# Altium schematic sheet 07.MCU_PE_PF.SchDoc
size 297 x 209 mm
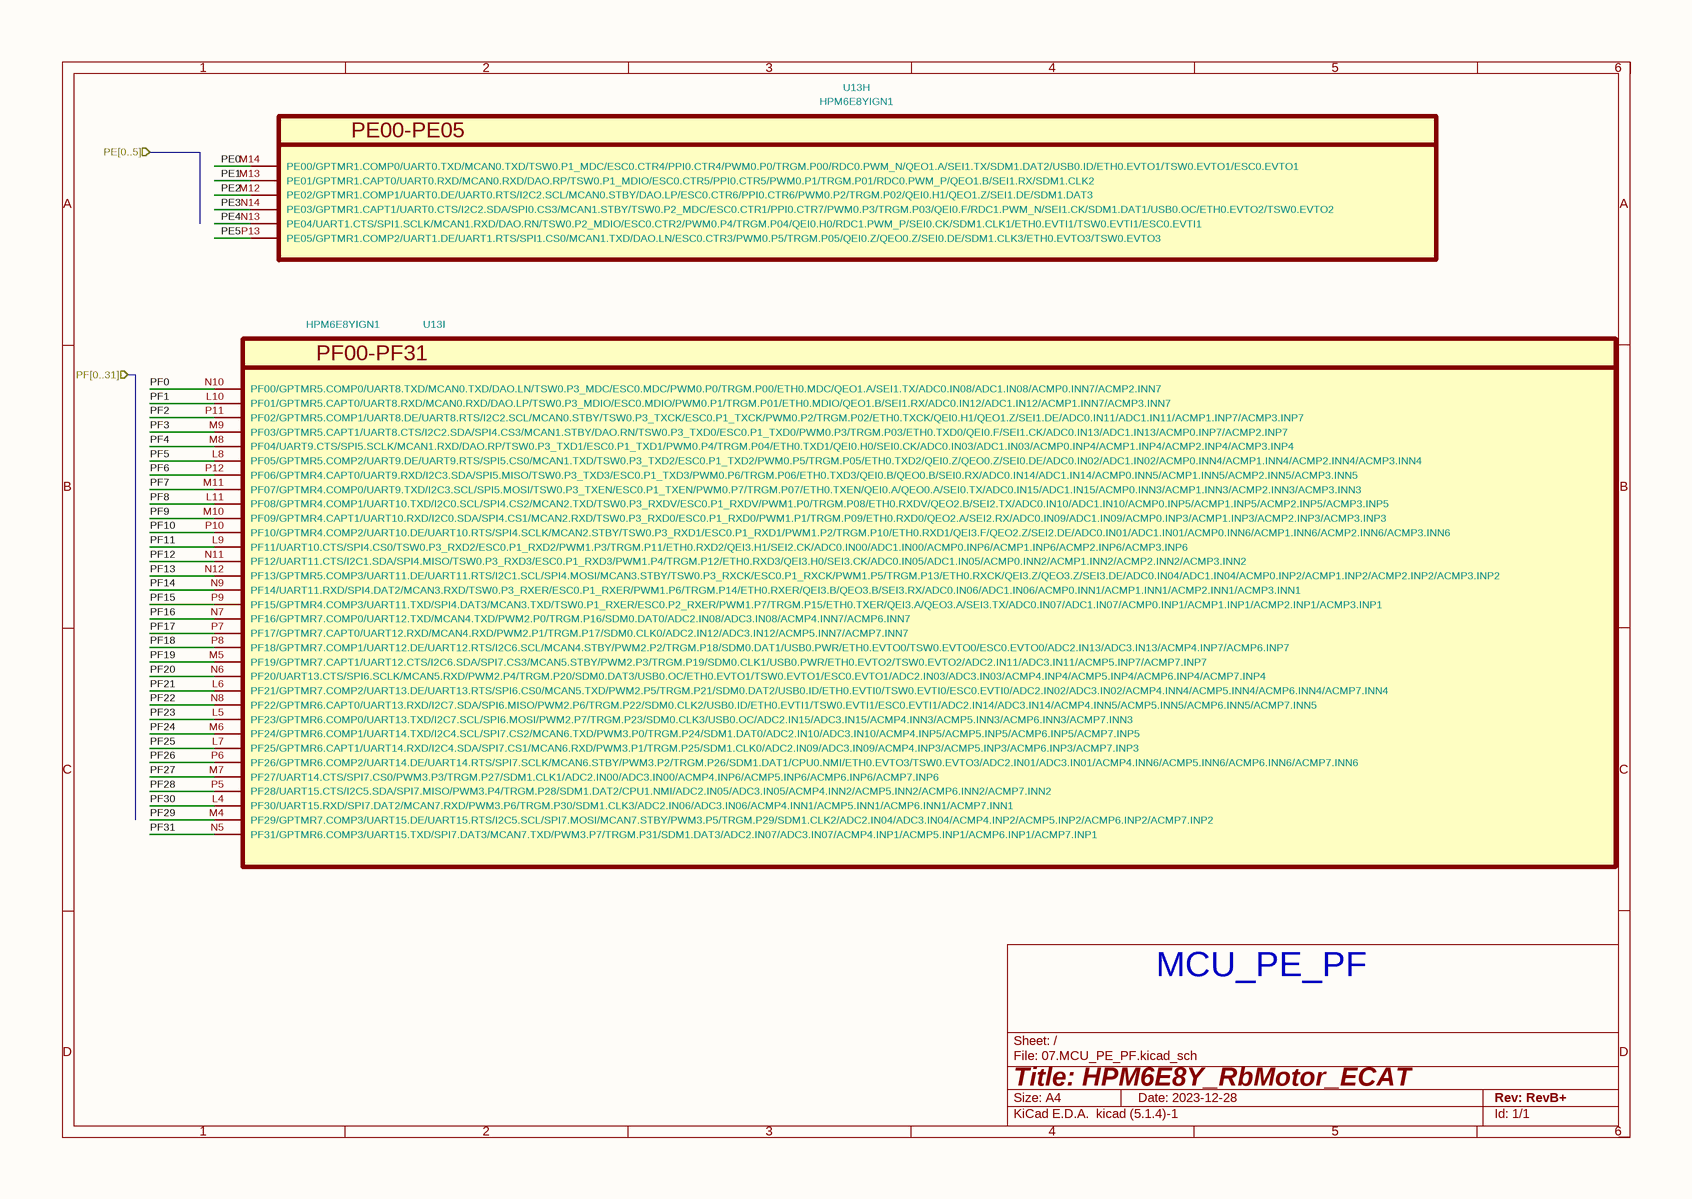
[diagram p0: 07.MCU_PE_PF.SchDoc]

## Parts
U13  HPM6E8YIGN1  [BGA-196_14x14_12.0x12.0mm_P0.8mm]  (parts H,I of 10)

## Ports
PE[0..5] (in), PF[0..31] (in)

## Nets
PE0: U13.M14(PE00/GPTMR1.COMP0/UART0.TXD/MCAN0.TXD/TSW0.P1_MDC/ESC0.CTR4/PPI0.CTR4/PWM0.P0/TRGM.P00/RDC0.PWM_N/QEO1.A/SEI1.TX/SDM1.DAT2/USB0.ID/ETH0.EVTO1/TSW0.EVTO1/ESC0.EVTO1)
PE1: U13.M13(PE01/GPTMR1.CAPT0/UART0.RXD/MCAN0.RXD/DAO.RP/TSW0.P1_MDIO/ESC0.CTR5/PPI0.CTR5/PWM0.P1/TRGM.P01/RDC0.PWM_P/QEO1.B/SEI1.RX/SDM1.CLK2)
PE2: U13.M12(PE02/GPTMR1.COMP1/UART0.DE/UART0.RTS/I2C2.SCL/MCAN0.STBY/DAO.LP/ESC0.CTR6/PPI0.CTR6/PWM0.P2/TRGM.P02/QEI0.H1/QEO1.Z/SEI1.DE/SDM1.DAT3)
PE3: U13.N14(PE03/GPTMR1.CAPT1/UART0.CTS/I2C2.SDA/SPI0.CS3/MCAN1.STBY/TSW0.P2_MDC/ESC0.CTR1/PPI0.CTR7/PWM0.P3/TRGM.P03/QEI0.F/RDC1.PWM_N/SEI1.CK/SDM1.DAT1/USB0.OC/ETH0.EVTO2/TSW0.EVTO2)
PE4: U13.N13(PE04/UART1.CTS/SPI1.SCLK/MCAN1.RXD/DAO.RN/TSW0.P2_MDIO/ESC0.CTR2/PWM0.P4/TRGM.P04/QEI0.H0/RDC1.PWM_P/SEI0.CK/SDM1.CLK1/ETH0.EVTI1/TSW0.EVTI1/ESC0.EVTI1)
PE5: U13.P13(PE05/GPTMR1.COMP2/UART1.DE/UART1.RTS/SPI1.CS0/MCAN1.TXD/DAO.LN/ESC0.CTR3/PWM0.P5/TRGM.P05/QEI0.Z/QEO0.Z/SEI0.DE/SDM1.CLK3/ETH0.EVTO3/TSW0.EVTO3)
PF0: U13.N10(PF00/GPTMR5.COMP0/UART8.TXD/MCAN0.TXD/DAO.LN/TSW0.P3_MDC/ESC0.MDC/PWM0.P0/TRGM.P00/ETH0.MDC/QEO1.A/SEI1.TX/ADC0.IN08/ADC1.IN08/ACMP0.INN7/ACMP2.INN7)
PF1: U13.L10(PF01/GPTMR5.CAPT0/UART8.RXD/MCAN0.RXD/DAO.LP/TSW0.P3_MDIO/ESC0.MDIO/PWM0.P1/TRGM.P01/ETH0.MDIO/QEO1.B/SEI1.RX/ADC0.IN12/ADC1.IN12/ACMP1.INN7/ACMP3.INN7)
PF2: U13.P11(PF02/GPTMR5.COMP1/UART8.DE/UART8.RTS/I2C2.SCL/MCAN0.STBY/TSW0.P3_TXCK/ESC0.P1_TXCK/PWM0.P2/TRGM.P02/ETH0.TXCK/QEI0.H1/QEO1.Z/SEI1.DE/ADC0.IN11/ADC1.IN11/ACMP1.INP7/ACMP3.INP7)
PF3: U13.M9(PF03/GPTMR5.CAPT1/UART8.CTS/I2C2.SDA/SPI4.CS3/MCAN1.STBY/DAO.RN/TSW0.P3_TXD0/ESC0.P1_TXD0/PWM0.P3/TRGM.P03/ETH0.TXD0/QEI0.F/SEI1.CK/ADC0.IN13/ADC1.IN13/ACMP0.INP7/ACMP2.INP7)
PF4: U13.M8(PF04/UART9.CTS/SPI5.SCLK/MCAN1.RXD/DAO.RP/TSW0.P3_TXD1/ESC0.P1_TXD1/PWM0.P4/TRGM.P04/ETH0.TXD1/QEI0.H0/SEI0.CK/ADC0.IN03/ADC1.IN03/ACMP0.INP4/ACMP1.INP4/ACMP2.INP4/ACMP3.INP4)
PF5: U13.L8(PF05/GPTMR5.COMP2/UART9.DE/UART9.RTS/SPI5.CS0/MCAN1.TXD/TSW0.P3_TXD2/ESC0.P1_TXD2/PWM0.P5/TRGM.P05/ETH0.TXD2/QEI0.Z/QEO0.Z/SEI0.DE/ADC0.IN02/ADC1.IN02/ACMP0.INN4/ACMP1.INN4/ACMP2.INN4/ACMP3.INN4)
PF6: U13.P12(PF06/GPTMR4.CAPT0/UART9.RXD/I2C3.SDA/SPI5.MISO/TSW0.P3_TXD3/ESC0.P1_TXD3/PWM0.P6/TRGM.P06/ETH0.TXD3/QEI0.B/QEO0.B/SEI0.RX/ADC0.IN14/ADC1.IN14/ACMP0.INN5/ACMP1.INN5/ACMP2.INN5/ACMP3.INN5)
PF7: U13.M11(PF07/GPTMR4.COMP0/UART9.TXD/I2C3.SCL/SPI5.MOSI/TSW0.P3_TXEN/ESC0.P1_TXEN/PWM0.P7/TRGM.P07/ETH0.TXEN/QEI0.A/QEO0.A/SEI0.TX/ADC0.IN15/ADC1.IN15/ACMP0.INN3/ACMP1.INN3/ACMP2.INN3/ACMP3.INN3)
PF8: U13.L11(PF08/GPTMR4.COMP1/UART10.TXD/I2C0.SCL/SPI4.CS2/MCAN2.TXD/TSW0.P3_RXDV/ESC0.P1_RXDV/PWM1.P0/TRGM.P08/ETH0.RXDV/QEO2.B/SEI2.TX/ADC0.IN10/ADC1.IN10/ACMP0.INP5/ACMP1.INP5/ACMP2.INP5/ACMP3.INP5)
PF9: U13.M10(PF09/GPTMR4.CAPT1/UART10.RXD/I2C0.SDA/SPI4.CS1/MCAN2.RXD/TSW0.P3_RXD0/ESC0.P1_RXD0/PWM1.P1/TRGM.P09/ETH0.RXD0/QEO2.A/SEI2.RX/ADC0.IN09/ADC1.IN09/ACMP0.INP3/ACMP1.INP3/ACMP2.INP3/ACMP3.INP3)
PF10: U13.P10(PF10/GPTMR4.COMP2/UART10.DE/UART10.RTS/SPI4.SCLK/MCAN2.STBY/TSW0.P3_RXD1/ESC0.P1_RXD1/PWM1.P2/TRGM.P10/ETH0.RXD1/QEI3.F/QEO2.Z/SEI2.DE/ADC0.IN01/ADC1.IN01/ACMP0.INN6/ACMP1.INN6/ACMP2.INN6/ACMP3.INN6)
PF11: U13.L9(PF11/UART10.CTS/SPI4.CS0/TSW0.P3_RXD2/ESC0.P1_RXD2/PWM1.P3/TRGM.P11/ETH0.RXD2/QEI3.H1/SEI2.CK/ADC0.IN00/ADC1.IN00/ACMP0.INP6/ACMP1.INP6/ACMP2.INP6/ACMP3.INP6)
PF12: U13.N11(PF12/UART11.CTS/I2C1.SDA/SPI4.MISO/TSW0.P3_RXD3/ESC0.P1_RXD3/PWM1.P4/TRGM.P12/ETH0.RXD3/QEI3.H0/SEI3.CK/ADC0.IN05/ADC1.IN05/ACMP0.INN2/ACMP1.INN2/ACMP2.INN2/ACMP3.INN2)
PF13: U13.N12(PF13/GPTMR5.COMP3/UART11.DE/UART11.RTS/I2C1.SCL/SPI4.MOSI/MCAN3.STBY/TSW0.P3_RXCK/ESC0.P1_RXCK/PWM1.P5/TRGM.P13/ETH0.RXCK/QEI3.Z/QEO3.Z/SEI3.DE/ADC0.IN04/ADC1.IN04/ACMP0.INP2/ACMP1.INP2/ACMP2.INP2/ACMP3.INP2)
PF14: U13.N9(PF14/UART11.RXD/SPI4.DAT2/MCAN3.RXD/TSW0.P3_RXER/ESC0.P1_RXER/PWM1.P6/TRGM.P14/ETH0.RXER/QEI3.B/QEO3.B/SEI3.RX/ADC0.IN06/ADC1.IN06/ACMP0.INN1/ACMP1.INN1/ACMP2.INN1/ACMP3.INN1)
PF15: U13.P9(PF15/GPTMR4.COMP3/UART11.TXD/SPI4.DAT3/MCAN3.TXD/TSW0.P1_RXER/ESC0.P2_RXER/PWM1.P7/TRGM.P15/ETH0.TXER/QEI3.A/QEO3.A/SEI3.TX/ADC0.IN07/ADC1.IN07/ACMP0.INP1/ACMP1.INP1/ACMP2.INP1/ACMP3.INP1)
PF16: U13.N7(PF16/GPTMR7.COMP0/UART12.TXD/MCAN4.TXD/PWM2.P0/TRGM.P16/SDM0.DAT0/ADC2.IN08/ADC3.IN08/ACMP4.INN7/ACMP6.INN7)
PF17: U13.P7(PF17/GPTMR7.CAPT0/UART12.RXD/MCAN4.RXD/PWM2.P1/TRGM.P17/SDM0.CLK0/ADC2.IN12/ADC3.IN12/ACMP5.INN7/ACMP7.INN7)
PF18: U13.P8(PF18/GPTMR7.COMP1/UART12.DE/UART12.RTS/I2C6.SCL/MCAN4.STBY/PWM2.P2/TRGM.P18/SDM0.DAT1/USB0.PWR/ETH0.EVTO0/TSW0.EVTO0/ESC0.EVTO0/ADC2.IN13/ADC3.IN13/ACMP4.INP7/ACMP6.INP7)
PF19: U13.M5(PF19/GPTMR7.CAPT1/UART12.CTS/I2C6.SDA/SPI7.CS3/MCAN5.STBY/PWM2.P3/TRGM.P19/SDM0.CLK1/USB0.PWR/ETH0.EVTO2/TSW0.EVTO2/ADC2.IN11/ADC3.IN11/ACMP5.INP7/ACMP7.INP7)
PF20: U13.N6(PF20/UART13.CTS/SPI6.SCLK/MCAN5.RXD/PWM2.P4/TRGM.P20/SDM0.DAT3/USB0.OC/ETH0.EVTO1/TSW0.EVTO1/ESC0.EVTO1/ADC2.IN03/ADC3.IN03/ACMP4.INP4/ACMP5.INP4/ACMP6.INP4/ACMP7.INP4)
PF21: U13.L6(PF21/GPTMR7.COMP2/UART13.DE/UART13.RTS/SPI6.CS0/MCAN5.TXD/PWM2.P5/TRGM.P21/SDM0.DAT2/USB0.ID/ETH0.EVTI0/TSW0.EVTI0/ESC0.EVTI0/ADC2.IN02/ADC3.IN02/ACMP4.INN4/ACMP5.INN4/ACMP6.INN4/ACMP7.INN4)
PF22: U13.N8(PF22/GPTMR6.CAPT0/UART13.RXD/I2C7.SDA/SPI6.MISO/PWM2.P6/TRGM.P22/SDM0.CLK2/USB0.ID/ETH0.EVTI1/TSW0.EVTI1/ESC0.EVTI1/ADC2.IN14/ADC3.IN14/ACMP4.INN5/ACMP5.INN5/ACMP6.INN5/ACMP7.INN5)
PF23: U13.L5(PF23/GPTMR6.COMP0/UART13.TXD/I2C7.SCL/SPI6.MOSI/PWM2.P7/TRGM.P23/SDM0.CLK3/USB0.OC/ADC2.IN15/ADC3.IN15/ACMP4.INN3/ACMP5.INN3/ACMP6.INN3/ACMP7.INN3)
PF24: U13.M6(PF24/GPTMR6.COMP1/UART14.TXD/I2C4.SCL/SPI7.CS2/MCAN6.TXD/PWM3.P0/TRGM.P24/SDM1.DAT0/ADC2.IN10/ADC3.IN10/ACMP4.INP5/ACMP5.INP5/ACMP6.INP5/ACMP7.INP5)
PF25: U13.L7(PF25/GPTMR6.CAPT1/UART14.RXD/I2C4.SDA/SPI7.CS1/MCAN6.RXD/PWM3.P1/TRGM.P25/SDM1.CLK0/ADC2.IN09/ADC3.IN09/ACMP4.INP3/ACMP5.INP3/ACMP6.INP3/ACMP7.INP3)
PF26: U13.P6(PF26/GPTMR6.COMP2/UART14.DE/UART14.RTS/SPI7.SCLK/MCAN6.STBY/PWM3.P2/TRGM.P26/SDM1.DAT1/CPU0.NMI/ETH0.EVTO3/TSW0.EVTO3/ADC2.IN01/ADC3.IN01/ACMP4.INN6/ACMP5.INN6/ACMP6.INN6/ACMP7.INN6)
PF27: U13.M7(PF27/UART14.CTS/SPI7.CS0/PWM3.P3/TRGM.P27/SDM1.CLK1/ADC2.IN00/ADC3.IN00/ACMP4.INP6/ACMP5.INP6/ACMP6.INP6/ACMP7.INP6)
PF28: U13.P5(PF28/UART15.CTS/I2C5.SDA/SPI7.MISO/PWM3.P4/TRGM.P28/SDM1.DAT2/CPU1.NMI/ADC2.IN05/ADC3.IN05/ACMP4.INN2/ACMP5.INN2/ACMP6.INN2/ACMP7.INN2)
PF29: U13.M4(PF29/GPTMR7.COMP3/UART15.DE/UART15.RTS/I2C5.SCL/SPI7.MOSI/MCAN7.STBY/PWM3.P5/TRGM.P29/SDM1.CLK2/ADC2.IN04/ADC3.IN04/ACMP4.INP2/ACMP5.INP2/ACMP6.INP2/ACMP7.INP2)
PF30: U13.L4(PF30/UART15.RXD/SPI7.DAT2/MCAN7.RXD/PWM3.P6/TRGM.P30/SDM1.CLK3/ADC2.IN06/ADC3.IN06/ACMP4.INN1/ACMP5.INN1/ACMP6.INN1/ACMP7.INN1)
PF31: U13.N5(PF31/GPTMR6.COMP3/UART15.TXD/SPI7.DAT3/MCAN7.TXD/PWM3.P7/TRGM.P31/SDM1.DAT3/ADC2.IN07/ADC3.IN07/ACMP4.INP1/ACMP5.INP1/ACMP6.INP1/ACMP7.INP1)

## Notes on the sheet
- MCU_PE_PF
- 1
- 2
- 3
- 4
- 5
- 6
- A
- B
- C
- D
- Title: HPM6E8Y_RbMotor_ECAT
- File: 07.MCU_PE_PF.kicad_sch
- Sheet: /
- KiCad E.D.A.  kicad (5.1.4)-1
- Size: A4
- Date: 2023-12-28
- Rev: RevB+
- Id: 1/1
- (in symbol HPM6E8YIGN1, part H) PE00-PE05
- (in symbol HPM6E8YIGN1, part I) PF00-PF31

## Library data of the parts
U13 = HPM6E8YIGN1: Value: HPM6E8YIGN1; Footprint: 00_HPM_Library:BGA-196_14x14_12.0x12.0mm_P0.8mm